# Altium project twofoot_Project.PrjPcb
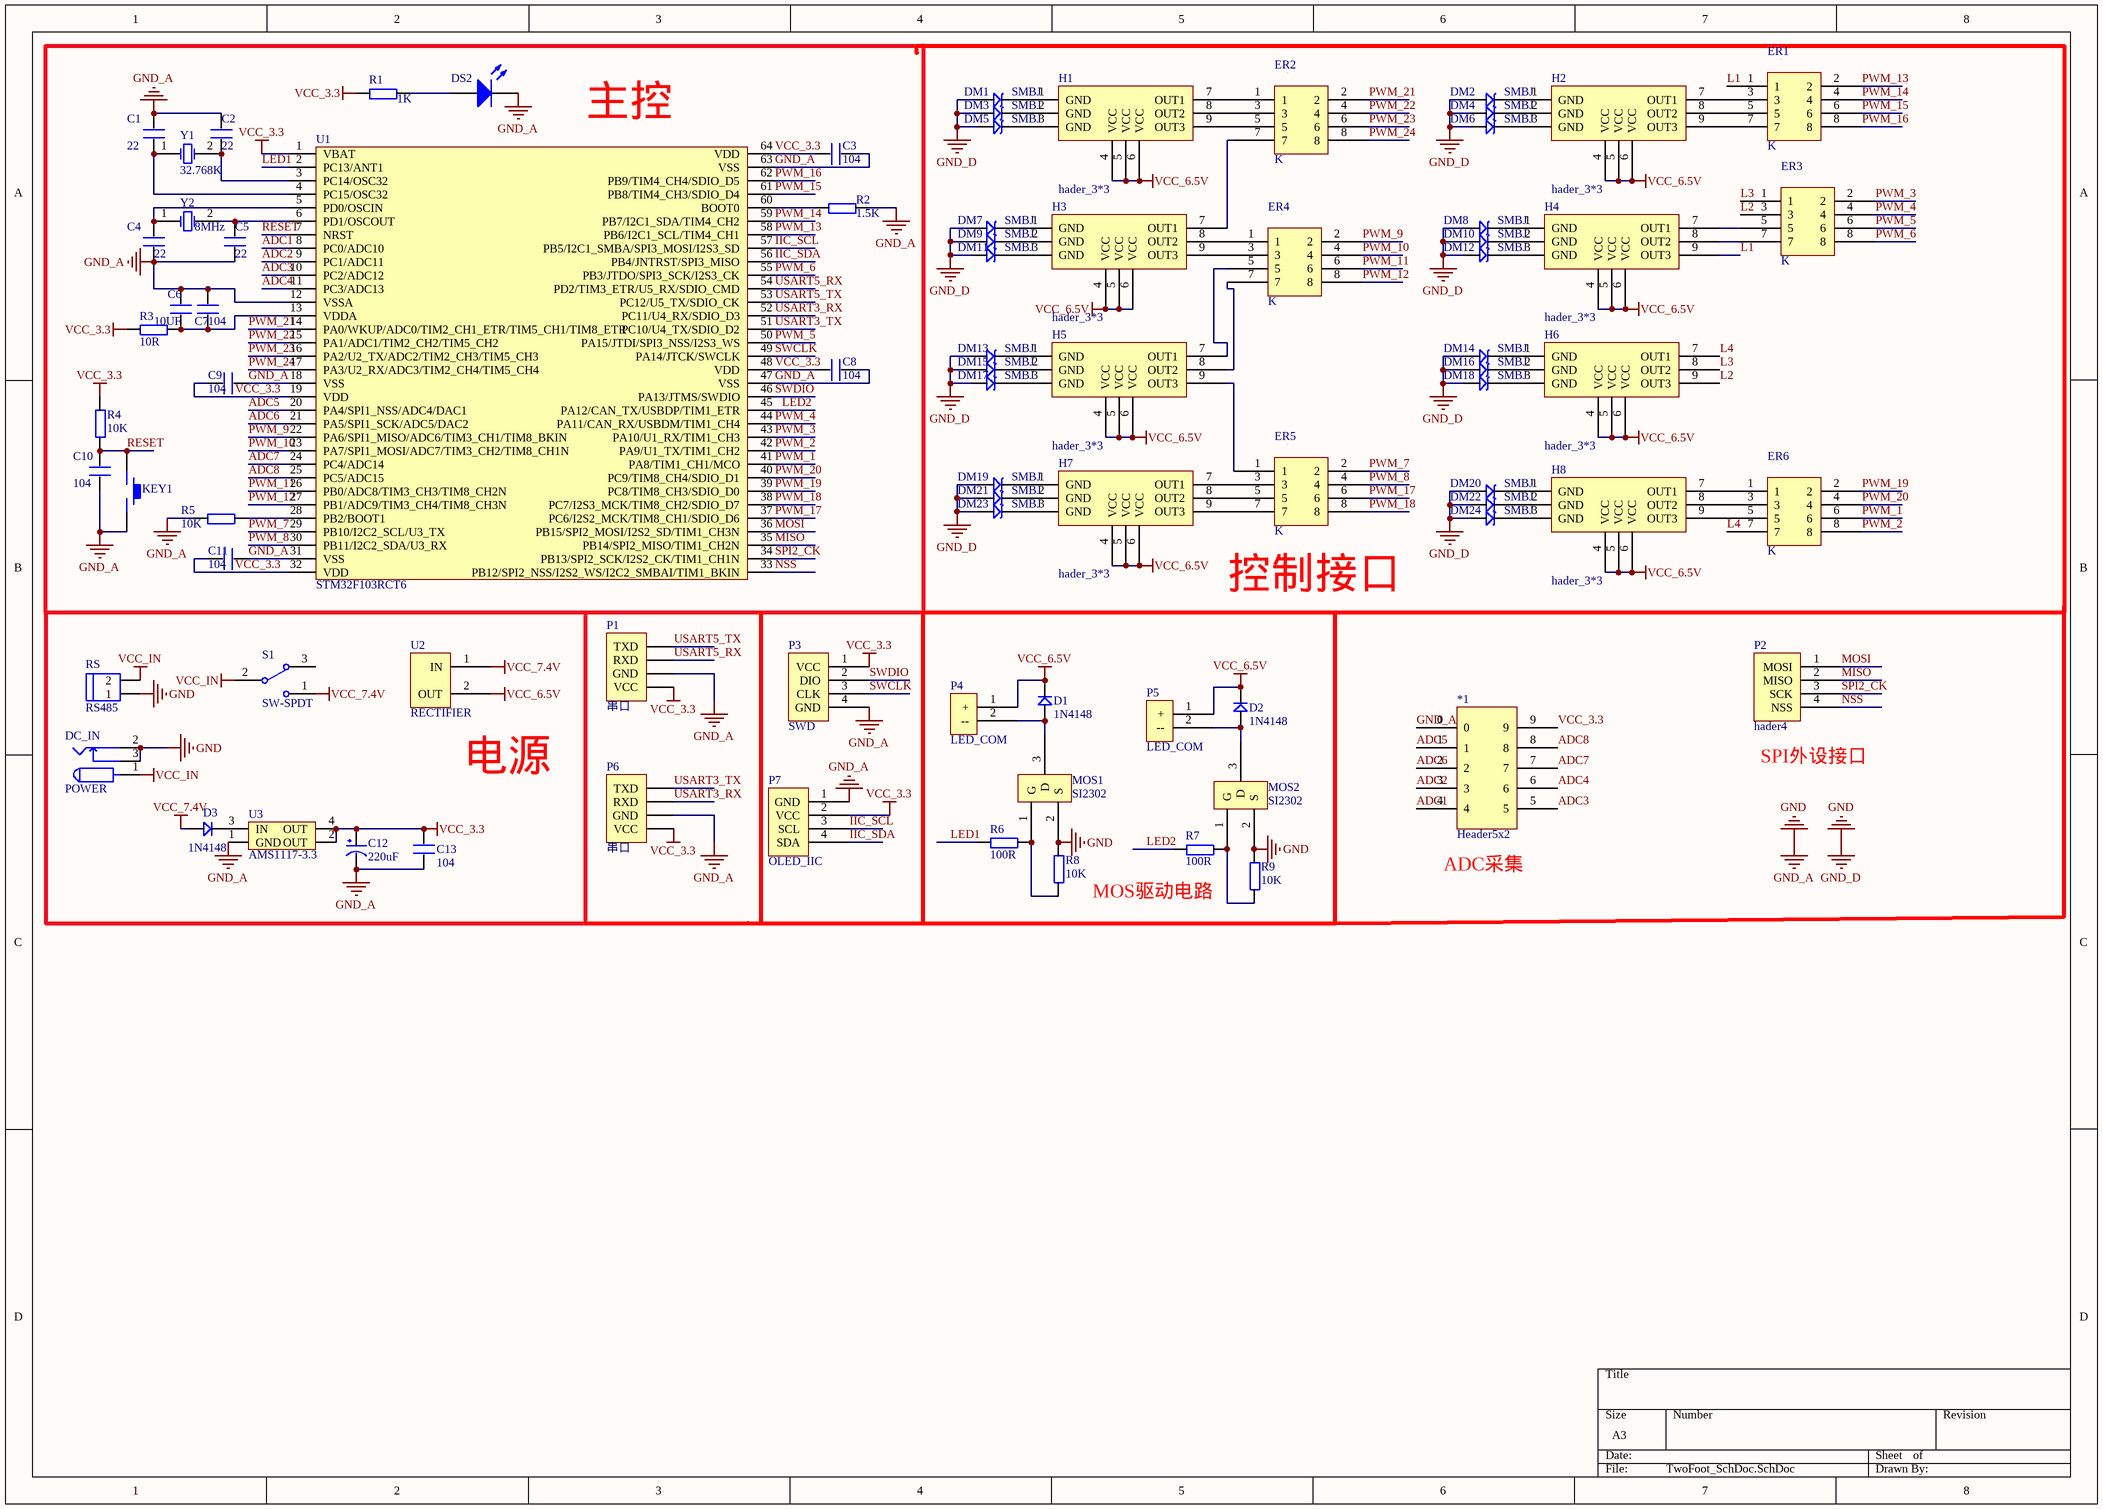
[diagram p0: TwoFoot_SchDoc.SchDoc]
1 sheet, 83 parts. Net scope: global (net labels, ports and power ports of the same name join across sheets).
Board file: TwoFoot_Src_PCB.PcbDoc

## Sheet TwoFoot_SchDoc.SchDoc
size A3

### Parts
*1  Header5x2  [HDR2X5]
C1  22  [0603P]
C2  22  [0603P]
C3  104  [0603P]
C4  22  [0603P]
C5  22  [0603P]
C6  10UF  [0603P]
C7  104  [0603P]
C8  104  [0603P]
C9  104  [0603P]
C10  104  [0603P]
C11  104  [0603P]
C12  220uF  [Cap1000uF]
C13  104  [0603P]
D1  1N4148  [DIODE_SOP]
D2  1N4148  [DIODE_SOP]
D3  1N4148  [DIODE_SOP]
DC_IN  POWER  [POWER_INDC]
DM1  SMBJ  [SMBJ]
DM2  SMBJ  [SMBJ]
DM3  SMBJ  [SMBJ]
DM4  SMBJ  [SMBJ]
DM5  SMBJ  [SMBJ]
DM6  SMBJ  [SMBJ]
DM7  SMBJ  [SMBJ]
DM8  SMBJ  [SMBJ]
DM9  SMBJ  [SMBJ]
DM10  SMBJ  [SMBJ]
DM11  SMBJ  [SMBJ]
DM12  SMBJ  [SMBJ]
DM13  SMBJ  [SMBJ]
DM14  SMBJ  [SMBJ]
DM15  SMBJ  [SMBJ]
DM16  SMBJ  [SMBJ]
DM17  SMBJ  [SMBJ]
DM18  SMBJ  [SMBJ]
DM19  SMBJ  [SMBJ]
DM20  SMBJ  [SMBJ]
DM21  SMBJ  [SMBJ]
DM22  SMBJ  [SMBJ]
DM23  SMBJ  [SMBJ]
DM24  SMBJ  [SMBJ]
DS2  LED2  [SMDLED]  (value not drawn)
ER1  K  [8P4R_0603]
ER2  K  [8P4R_0603]
ER3  K  [8P4R_0603]
ER4  K  [8P4R_0603]
ER5  K  [8P4R_0603]
ER6  K  [8P4R_0603]
H1  hader_3*3  [heard3X3]
H2  hader_3*3  [heard3X3]
H3  hader_3*3  [heard3X3]
H4  hader_3*3  [heard3X3]
H5  hader_3*3  [heard3X3]
H6  hader_3*3  [heard3X3]
H7  hader_3*3  [heard3X3]
H8  hader_3*3  [heard3X3]
KEY1  KEY_M  [SW_PB2_A1]  (value not drawn)
MOS1  SI2302  [SOT-23R]
MOS2  SI2302  [SOT-23R]
P1  串口  [HDR1X4]
P2  hader4  [HDR1X4 _NSS]
P3  SWD  [HDR1X4 _S]
P4  LED_COM  [HDR2]
P5  LED_COM  [HDR2]
P6  串口  [HDR1X4]
P7  OLED_IIC  [HDR1X4 _OLED]
R1  1K  [0603P]
R2  1.5K  [0603P]
R3  10R  [0603P]
R4  10K  [0603P]
R5  10K  [0603P]
R6  100R  [0603P]
R7  100R  [0603P]
R8  10K  [0603P]
R9  10K  [0603P]
RS  RS485  [POWER_INCOM]
S1  SW-SPDT  [纽子开关]
U1  STM32F103RCT6  [LQFP64]
U2  RECTIFIER  [RECTIFIER]
U3  AMS1117-3.3  [AMS1117]
Y1  32.768K  [XTAL32]
Y2  8MHz  [XTAL_US]

### Blocks framed on the sheet
主控: C1-C11 DS2 KEY1 R1-R5 U1 Y1 Y2

### Nets
GND_A: *1.0 C1.1 C2.2 C3.1 C4.2 C5.1 C6.1 C7.2 C8.1 C9.2 C10.1 C11.2 C12.2(GND) C13.1 DC_IN.2 DC_IN.3 DM1.1 DM2.1 DM3.1 DM4.1 DM5.1 DM6.1 DM7.1 DM8.1 DM9.1 DM10.1 DM11.1 DM12.1 DM13.1 DM14.1 DM15.1 DM16.1 DM17.1 DM18.1 DM19.1 DM20.1 DM21.1 DM22.1 DM23.1 DM24.1 DS2.2(K) KEY1.2 MOS1.2(S) MOS2.2(S) P1.2(GND) P3.4(GND) P6.2(GND) P7.1(GND) R2.2 R5.1 R8.2 R9.2 RS.1 U1.12(VSSA) U1.18(VSS) U1.31(VSS) U1.47(VSS) U1.63(VSS) U3.1(GND)  [also labelled GND, GND_D]
VCC_3.3: *1.9 C3.2 C8.2 C9.1 C11.1 C12.1(VCC) C13.2 P1.1(VCC) P3.1(VCC) P6.1(VCC) P7.2(VCC) R1.1 R3.1 R4.2 U1.1(VBAT) U1.19(VDD) U1.32(VDD) U1.48(VDD) U1.64(VDD) U3.2(OUT) U3.4(OUT)
VCC_6.5V: D1.2 D2.2 H1.4(VCC) H1.5(VCC) H1.6(VCC) H2.4(VCC) H2.5(VCC) H2.6(VCC) H3.4(VCC) H3.5(VCC) H3.6(VCC) H4.4(VCC) H4.5(VCC) H4.6(VCC) H5.4(VCC) H5.5(VCC) H5.6(VCC) H6.4(VCC) H6.5(VCC) H6.6(VCC) H7.4(VCC) H7.5(VCC) H7.6(VCC) H8.4(VCC) H8.5(VCC) H8.6(VCC) P4.1(+) P5.1(+) U2.2(OUT)
VCC_7.4V: D3.1 S1.1 U2.1(IN)
VCC_IN: DC_IN.1 RS.2 S1.2
ADC1: *1.4 U1.8(PC0/ADC10)
ADC2: *1.3 U1.9(PC1/ADC11)
ADC3: *1.5 U1.10(PC2/ADC12)
ADC4: *1.6 U1.11(PC3/ADC13)
ADC5: *1.1 U1.20(PA4/SPI1_NSS/ADC4/DAC1)
ADC6: *1.2 U1.21(PA5/SPI1_SCK/ADC5/DAC2)
ADC7: *1.7 U1.24(PC4/ADC14)
ADC8: *1.8 U1.25(PC5/ADC15)
IIC_SCL: P7.3(SCL) U1.57(PB5/I2C1_SMBA/SPI3_MOSI/I2S3_SD)
IIC_SDA: P7.4(SDA) U1.56(PB4/JNTRST/SPI3_MISO)
L1: ER1.1 H4.9(OUT3)
L2: ER3.3 H6.9(OUT3)
L3: ER3.1 H6.8(OUT2)
L4: ER6.7 H6.7(OUT1)
LED1: R6.1 U1.2(PC13/ANT1)
LED2: R7.1 U1.45(PA12/CAN_TX/USBDP/TIM1_ETR)
MISO: P2.2(MISO) U1.35(PB14/SPI2_MISO/TIM1_CH2N)
MOSI: P2.1(MOSI) U1.36(PB15/SPI2_MOSI/I2S2_SD/TIM1_CH3N)
NSS: P2.4(NSS) U1.33(PB12/SPI2_NSS/I2S2_WS/I2C2_SMBAI/TIM1_BKIN)
PWM_1: ER6.6 U1.41(PA8/TIM1_CH1/MCO)
PWM_2: ER6.8 U1.42(PA9/U1_TX/TIM1_CH2)
PWM_3: ER3.2 U1.43(PA10/U1_RX/TIM1_CH3)
PWM_4: ER3.4 U1.44(PA11/CAN_RX/USBDM/TIM1_CH4)
PWM_5: ER3.6 U1.50(PA15/JTDI/SPI3_NSS/I2S3_WS)
PWM_6: ER3.8 U1.55(PB3/JTDO/SPI3_SCK/I2S3_CK)
PWM_7: ER5.2 U1.29(PB10/I2C2_SCL/U3_TX)
PWM_8: ER5.4 U1.30(PB11/I2C2_SDA/U3_RX)
PWM_9: ER4.2 U1.22(PA6/SPI1_MISO/ADC6/TIM3_CH1/TIM8_BKIN)
PWM_10: ER4.4 U1.23(PA7/SPI1_MOSI/ADC7/TIM3_CH2/TIM8_CH1N)
PWM_11: ER4.6 U1.26(PB0/ADC8/TIM3_CH3/TIM8_CH2N)
PWM_12: ER4.8 U1.27(PB1/ADC9/TIM3_CH4/TIM8_CH3N)
PWM_13: ER1.2 U1.58(PB6/I2C1_SCL/TIM4_CH1)
PWM_14: ER1.4 U1.59(PB7/I2C1_SDA/TIM4_CH2)
PWM_15: ER1.6 U1.61(PB8/TIM4_CH3/SDIO_D4)
PWM_16: ER1.8 U1.62(PB9/TIM4_CH4/SDIO_D5)
PWM_17: ER5.6 U1.37(PC6/I2S2_MCK/TIM8_CH1/SDIO_D6)
PWM_18: ER5.8 U1.38(PC7/I2S3_MCK/TIM8_CH2/SDIO_D7)
PWM_19: ER6.2 U1.39(PC8/TIM8_CH3/SDIO_D0)
PWM_20: ER6.4 U1.40(PC9/TIM8_CH4/SDIO_D1)
PWM_21: ER2.2 U1.14(PA0/WKUP/ADC0/TIM2_CH1_ETR/TIM5_CH1/TIM8_ETR)
PWM_22: ER2.4 U1.15(PA1/ADC1/TIM2_CH2/TIM5_CH2)
PWM_23: ER2.6 U1.16(PA2/U2_TX/ADC2/TIM2_CH3/TIM5_CH3)
PWM_24: ER2.8 U1.17(PA3/U2_RX/ADC3/TIM2_CH4/TIM5_CH4)
RESET: C10.2 KEY1.1 R4.1 U1.7(NRST)
SPI2_CK: P2.3(SCK) U1.34(PB13/SPI2_SCK/I2S2_CK/TIM1_CH1N)
SWCLK: P3.3(CLK) U1.49(PA14/JTCK/SWCLK)
SWDIO: P3.2(DIO) U1.46(PA13/JTMS/SWDIO)
USART3_RX: P6.3(RXD) U1.52(PC11/U4_RX/SDIO_D3)
USART3_TX: P6.4(TXD) U1.51(PC10/U4_TX/SDIO_D2)
USART5_RX: P1.3(RXD) U1.54(PD2/TIM3_ETR/U5_RX/SDIO_CMD)
USART5_TX: P1.4(TXD) U1.53(PC12/U5_TX/SDIO_CK)
NetC1_2: C1.2 U1.4(PC15/OSC32) Y1.1(OSC1)
NetC2_1: C2.1 U1.3(PC14/OSC32) Y1.2(OSC2)
NetC4_1: C4.1 U1.5(PD0/OSCIN) Y2.1(OSC1)
NetC5_2: C5.2 U1.6(PD1/OSCOUT) Y2.2(OSC2)
NetC6_2: C6.2 C7.1 R3.2 U1.13(VDDA)
NetD1_1: D1.1 MOS1.3(D) P4.2(--)
NetD2_1: D2.1 MOS2.3(D) P5.2(--)
NetD3_2: D3.2 U3.3(IN)
NetDM1_2: DM1.2 H1.1(GND)
NetDM2_2: DM2.2 H2.1(GND)
NetDM3_2: DM3.2 H1.2(GND)
NetDM4_2: DM4.2 H2.2(GND)
NetDM5_2: DM5.2 H1.3(GND)
NetDM6_2: DM6.2 H2.3(GND)
NetDM7_2: DM7.2 H3.1(GND)
NetDM8_2: DM8.2 H4.1(GND)
NetDM9_2: DM9.2 H3.2(GND)
NetDM10_2: DM10.2 H4.2(GND)
NetDM11_2: DM11.2 H3.3(GND)
NetDM12_2: DM12.2 H4.3(GND)
NetDM13_2: DM13.2 H5.1(GND)
NetDM14_2: DM14.2 H6.1(GND)
NetDM15_2: DM15.2 H5.2(GND)
NetDM16_2: DM16.2 H6.2(GND)
NetDM17_2: DM17.2 H5.3(GND)
NetDM18_2: DM18.2 H6.3(GND)
NetDM19_2: DM19.2 H7.1(GND)
NetDM20_2: DM20.2 H8.1(GND)
NetDM21_2: DM21.2 H7.2(GND)
NetDM22_2: DM22.2 H8.2(GND)
NetDM23_2: DM23.2 H7.3(GND)
NetDM24_2: DM24.2 H8.3(GND)
NetDS2_1: DS2.1(A) R1.2
NetER1_3: ER1.3 H2.7(OUT1)
NetER1_5: ER1.5 H2.8(OUT2)
NetER1_7: ER1.7 H2.9(OUT3)
NetER2_1: ER2.1 H1.7(OUT1)
NetER2_3: ER2.3 H1.8(OUT2)
NetER2_5: ER2.5 H1.9(OUT3)
NetER2_7: ER2.7 H3.7(OUT1)
NetER3_5: ER3.5 H4.7(OUT1)
NetER3_7: ER3.7 H4.8(OUT2)
NetER4_1: ER4.1 H3.8(OUT2)
NetER4_3: ER4.3 H3.9(OUT3)
NetER4_5: ER4.5 H5.7(OUT1)
NetER4_7: ER4.7 H5.8(OUT2)
NetER5_1: ER5.1 H5.9(OUT3)
NetER5_3: ER5.3 H7.7(OUT1)
NetER5_5: ER5.5 H7.8(OUT2)
NetER5_7: ER5.7 H7.9(OUT3)
NetER6_1: ER6.1 H8.7(OUT1)
NetER6_3: ER6.3 H8.8(OUT2)
NetER6_5: ER6.5 H8.9(OUT3)
NetMOS1_1: MOS1.1(G) R6.2 R8.1
NetMOS2_1: MOS2.1(G) R7.2 R9.1
NetR2_1: R2.1 U1.60(BOOT0)
NetR5_2: R5.2 U1.28(PB2/BOOT1)

Not connected (* = marked no-connect by the designer): S1 3

### Notes on the sheet
- 控制接口
- (near U2) 电源
- (near P2) SPI外设接口
- MOS驱动电路
- (near *1) ADC采集

### Library data of the parts
C1-C11 C13 = C
C12 = CAP
D1-D3 = D
DC_IN = POWER_INDC
DM1-DM24 = SMBJ: 保险管5.0A
DS2 = LED2: Typical RED, GREEN, YELLOW, AMBER GaAs LED; Published: 8-Jun-2000; LatestRevisionDate: 17-Jul-2002; LatestRevisionNote: Re-released for DXP Platform.; PackageDocument: Feb-2002; PackageReference: 3.2X1.6X1.1; Publisher: Altium Limited
ER1-ER6 = 0606_exclusion: 排阻
MOS1 MOS2 = MOS管
P1 P6 = Header 4_1: LatestRevisionDate: 17-Jul-2002; LatestRevisionNote: Re-released for DXP Platform.; Publisher: Altium Limited
P2 = hader4: NSS
P3 = Header 4: LatestRevisionDate: 17-Jul-2002; LatestRevisionNote: Re-released for DXP Platform.; Publisher: Altium Limited
P4 P5 = COM_LED
R1-R9 = R
RS = POWER_INCOM
S1 = SW-SPDT: 开关; Published: 24-Mar-1999; LatestRevisionDate: 17-Dec-2003; LatestRevisionNote: Schematic revised, PCB Footprint replaced.; DatasheetDocument: 05-Dec-2000; PackageReference: TL36WW15050; Publisher: Altium Limited; ComponentLink1Description: Manufacturer Link; ComponentLink1URL: http://www.apem.com
U2 = RECTIFIER: 整流桥
U3 = AMS1117
Y1 Y2 = XTAL: Crystal Oscillator; Published: 8-Jun-2000; LatestRevisionDate: 17-Jul-2002; LatestRevisionNote: Re-released for DXP Platform.; Publisher: Altium Limited